# Altium schematic sheet ESP32.SchDoc
size A4; SheetNumber: 1; SheetTotal: 4
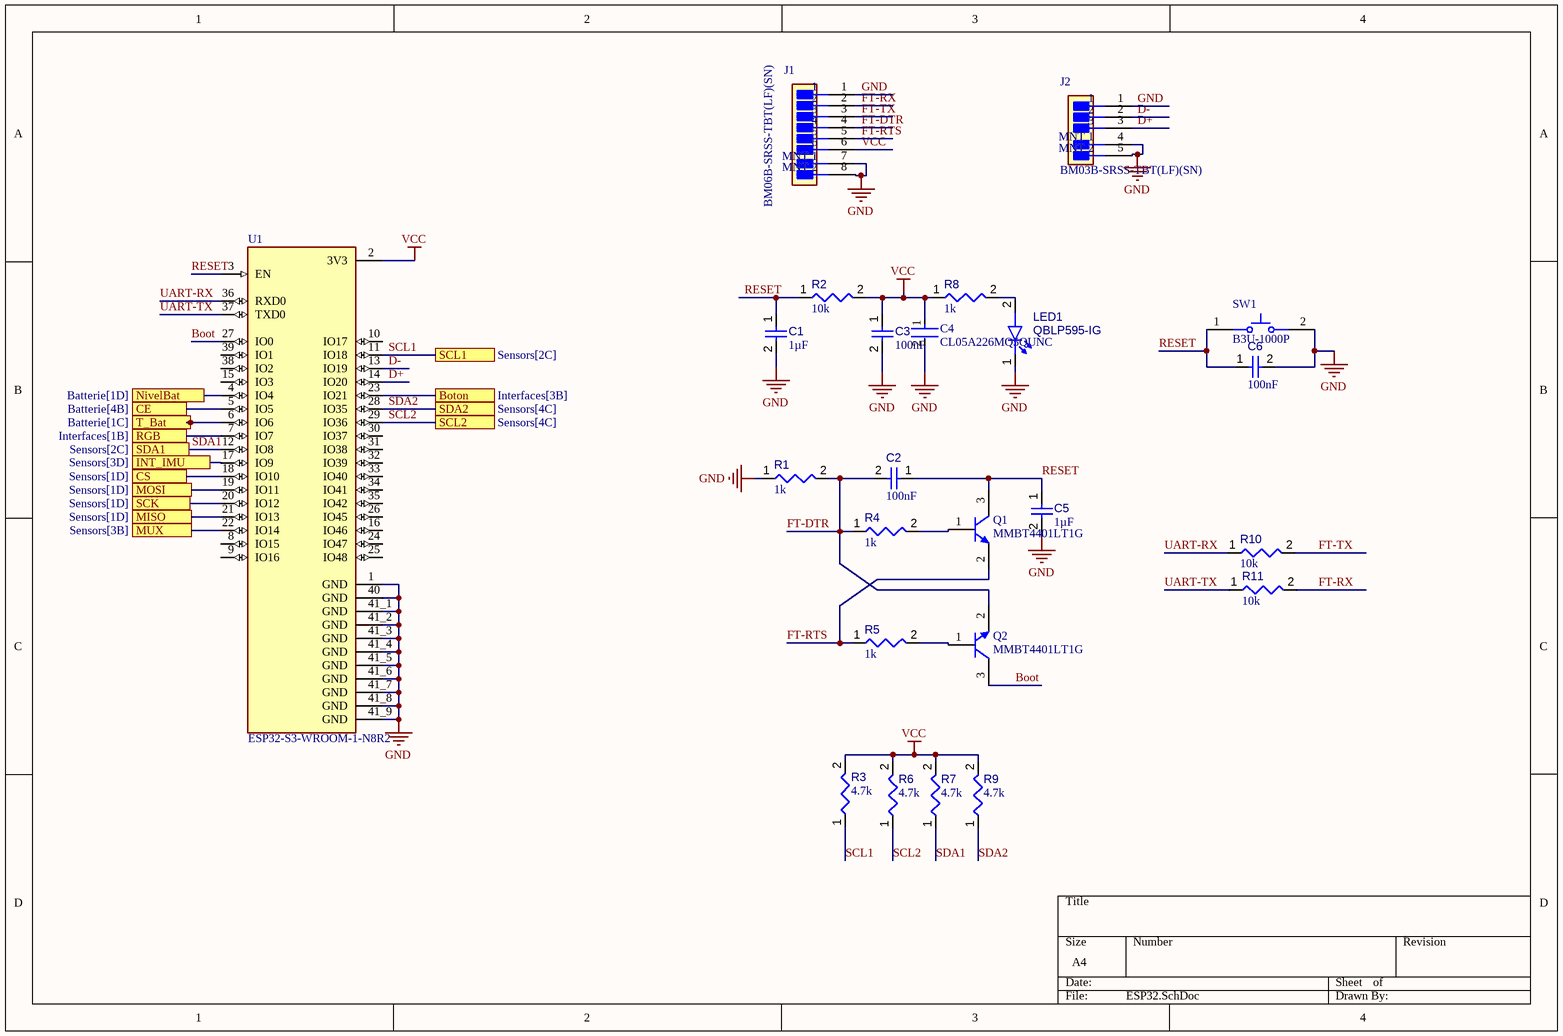
[diagram p0: ESP32.SchDoc]

## Parts
C1  value 1µF  [CAPC1005X55X25LL05T10]  (hidden comment: Capacitor 1 uF +/- 10% 6.3 V 0402)
C2  value 100nF  [CAPC1005X56X25LL10T15]  (hidden comment: Capacitor 0.1 uF +/- 5% 16 V 0402)
C3  value 100nF  [CAPC1005X56X25LL10T15]  (hidden comment: Capacitor 0.1 uF +/- 5% 16 V 0402)
C4  CL05A226MQ5QUNC  [FP-CL746-IPC_C]
C5  value 1µF  [CAPC1005X55X25LL05T10]  (hidden comment: Capacitor 1 uF +/- 10% 6.3 V 0402)
C6  value 100nF  [CAPC1005X56X25LL10T15]  (hidden comment: Capacitor 0.1 uF +/- 5% 16 V 0402)
J1  BM06B-SRSS-TBT(LF)(SN)  [FP-BM06B-SRSS-TBT_LF_SN-MFG]
J2  BM03B-SRSS-TBT(LF)(SN)  [FP-BM03B-SRSS-TBT_LF_SN-MFG]
LED1  QBLP595-IG  [QTB-QBLP595_V]
Q1  MMBT4401LT1G  [ONSC-SOT-23-3-318-08_V]
Q2  MMBT4401LT1G  [ONSC-SOT-23-3-318-08_V]
R1  value 1k  [RESC0402(1005)_L]  (hidden comment: Resistor 1K +/-5 % 0402 63 mW)
R2  value 10k  [RESC0402(1005)_L]  (hidden comment: Resistor 10K  +/-1 % 0402 63 mW)
R3  value 4.7k  [RESC1005X40X25ML05T05]  (hidden comment: Resistor 4k7 +/-1% 0402 100 mW)
R4  value 1k  [RESC0402(1005)_L]  (hidden comment: Resistor 1K +/-5 % 0402 63 mW)
R5  value 1k  [RESC0402(1005)_L]  (hidden comment: Resistor 1K +/-5 % 0402 63 mW)
R6  value 4.7k  [RESC1005X40X25ML05T05]  (hidden comment: Resistor 4k7 +/-1% 0402 100 mW)
R7  value 4.7k  [RESC1005X40X25ML05T05]  (hidden comment: Resistor 4k7 +/-1% 0402 100 mW)
R8  value 1k  [RESC0402(1005)_L]  (hidden comment: Resistor 1K +/-5 % 0402 63 mW)
R9  value 4.7k  [RESC1005X40X25ML05T05]  (hidden comment: Resistor 4k7 +/-1% 0402 100 mW)
R10  value 10k  [RESC0402(1005)_L]  (hidden comment: Resistor 10K  +/-1 % 0402 63 mW)
R11  value 10k  [RESC0402(1005)_L]  (hidden comment: Resistor 10K  +/-1 % 0402 63 mW)
SW1  B3U-1000P  [OMRON-B3U-1000_V]
U1  ESP32-S3-WROOM-1-N8R2  [XCVR_ESP32-S3-WROOM-1-N8R2]

## Ports
Boton (see Interfaces[3B]), CE (see Batterie[4B]), CS (see Sensors[1D]), INT_IMU (see Sensors[3D]), MISO (see Sensors[1D]), MOSI (see Sensors[1D]), MUX (see Sensors[3B]), NivelBat (see Batterie[1D]), RGB (see Interfaces[1B]), SCK (see Sensors[1D]), SCL1 (see Sensors[2C]), SCL2 (see Sensors[4C]), SDA1 (see Sensors[2C]), SDA2 (see Sensors[4C]), T_Bat (see Batterie[1C])

## Nets
GND: C1.2 C3.2 C4.2 C5.2 C6.2 J1.1 J1.7(MNT_1) J1.8(MNT_2) J2.1 J2.4(MNT_1) J2.5(MNT_2) LED1.1(K) R1.1 SW1.2 U1.1(GND) U1.40(GND) U1.41_1(GND) U1.41_2(GND) U1.41_3(GND) U1.41_4(GND) U1.41_5(GND) U1.41_6(GND) U1.41_7(GND) U1.41_8(GND) U1.41_9(GND)
VCC: C3.1 C4.1 J1.6 R2.2 R3.2 R6.2 R7.2 R8.1 R9.2 U1.2(3V3)
Boot: Q2.3(C) U1.27(IO0)
Boton: U1.23(IO21) ; port Boton
CE: U1.5(IO5) ; port CE
CS: U1.18(IO10) ; port CS
D+: J2.3 U1.14(IO20)
D-: J2.2 U1.13(IO19)
FT-DTR: C2.2 J1.4 Q2.2(E) R1.2 R4.1
FT-RTS: J1.5 Q1.2(E) R5.1
FT-RX: J1.2 R11.2
FT-TX: J1.3 R10.2
INT_IMU: U1.17(IO9) ; port INT_IMU
MISO: U1.21(IO13) ; port MISO
MOSI: U1.19(IO11) ; port MOSI
MUX: U1.22(IO14) ; port MUX
NivelBat: U1.4(IO4) ; port NivelBat
RESET: C1.1 C2.1 C5.1 C6.1 Q1.3(C) R2.1 SW1.1 U1.3(EN)
RGB: U1.7(IO7) ; port RGB
SCK: U1.20(IO12) ; port SCK
SCL1: R3.1 U1.11(IO18) ; port SCL1
SCL2: R6.1 U1.29(IO36) ; port SCL2
SDA1: R7.1 U1.12(IO8) ; port SDA1
SDA2: R9.1 U1.28(IO35) ; port SDA2
T_Bat: U1.6(IO6) ; port T_Bat
UART-RX: R10.1 U1.36(RXD0)
UART-TX: R11.1 U1.37(TXD0)
NetLED1_2: LED1.2(A) R8.2
NetQ1_1: Q1.1(B) R4.2
NetQ2_1: Q2.1(B) R5.2

Not connected (* = marked no-connect by the designer): U1 8(IO15) 9(IO16) 10(IO17) 15(IO3) 16(IO46) 24(IO47) 25(IO48) 26(IO45) 30(IO37) 31(IO38) 32(IO39) 33(IO40) 34(IO41) 35(IO42) 38(IO2) 39(IO1)

## Library data of the parts
C1 C5 = CMP-001-00008-6: Chip Capacitor, 1 uF, +/- 10%, 6.3 V, 0402 (1005 Metric); Capacitor Type: Ceramic; Voltage Rating: 6.3V; Max Operating Temperature: 85°C; Mounting Technology: SM; Tolerance: 10%; Case/Package: 0402; RoHS Compliant: True; Min Operating Temperature: -55°C; Pins: 2
C2 C3 C6 = CMP-001-00001-6: Chip Capacitor, 0.1 uF, +/- 5%, 16 V, 0402 (1005 Metric); Capacitor Type: Ceramic; Voltage Rating: 16V; Max Operating Temperature: 125°C; Min Operating Temperature: -55°C; Case/Package: 0402; Mounting Technology: SM; Pins: 2; Tolerance: 5%; RoHS Compliant: True
C4 = CMP-13271-000286-1: Cap Ceramic 22uF 6.3V X5R ±20% SMD 0402 +85°C Paper T/R; Case Code (Imperial): 0402; Tolerance: 20%; Width: 0.02inch; Packaging: Tape and Reel; Case/Package: 0402; Min Operating Temperature: -55°C; Max Operating Temperature: 85°C; Voltage Rating: 6.3V; Capacitance: 22uF; Thickness: 0.022inch; Mount: Surface Mount; Length: 0.039inch; Case Code (Metric): 1005
J1 = CMP-00030-00001-2: Conn Shrouded Header HDR 6 POS 1mm Solder ST SMD Embossed T/R
J2 = CMP-00030-00002-2: Conn Shrouded Header (4 Sides) HDR 3 POS 1mm Solder ST Top Entry SMD T/R
LED1 = CMP-007-00041-3: Chip LED 0402, Green, 0.02 A, 3.1 to 3.7 V, -40 to 80 degC, 2-Pin SMD, RoHS, Tape and Reel; Case/Package: 0402; Colour: Green; Mounting Technology: SMT; Pins: 2; RoHS Compliant: Yes
Q1 Q2 = CMP-1048-00545-1: Switching Transistor, NPN Silicon, 3-Pin SOT-23, Pb-Free, Tape and Reel; Manufacturer: On Semiconductor; IC Continuous (A): 0.6; fT Min (MHz): 250; Mounting Technology: Surface Mount; ComponentLink2URL: http://www.onsemi.cn/pub_link/Collateral/MMBT4401LT1-D.PDF; PackageDescription: 3-Pin Small Outline Transistor, Body 2.92 x 1.3 mm, Pitch 0.95 mm; ComponentLink3Description: Package Specification; Polarity: NPN; PackageReference: SOT-23-3-318-08; PackageVersion: Rev. AP, 11/2009; ComponentLink1URL: http://www.onsemi.com/; ComponentLink3URL: http://www.onsemi.cn/pub_link/Collateral/318-08.PDF; Packing: Tape and Reel; ComponentLink1Description: Manufacturer URL; PartNumber: MMBT4401LT1G; RoHS: TRUE; ComponentLink2Description: Datasheet; DatasheetVersion: Rev. 10
R1 R4 R5 R8 = CMP-009-00157-3: Chip Resistor, 1 kOhms, +/-5 %, 63 mW, -55 to 155 degC, 0402; Tolerance: 5%; Power: 63mW; Case/Package: 0402; Pins: 2; Min Operating Temperature: -55°C; Max Operating Temperature: 155°C
R2 R10 R11 = CMP-009-00149-3: Chip Resistor, 10 kOhms, +/-1 %, 63 mW, -55 to 125 degC, 0402; Power: 63mW; Tolerance: 1%; Min Operating Temperature: -55°C; Case/Package: 0402; Max Operating Temperature: 155°C; Pins: 2
R3 R6 R7 R9 = CMP-009-00030-5: Chip Resistor, 4.7 KOhm, +/- 1%, 0.1 W, -55 to 155 degC, 0402 (1005 Metric); Power: 100mW; Voltage Rating: 50V; Mounting Technology: SM; RoHS Compliant: True; Tolerance: 1%; Min Operating Temperature: -55°C; Max Operating Temperature: 155°C; Case/Package: 0402; Pins: 2
SW1 = CMP-011-00000-2: Tactile Switch, SPST-NO, 0.05 A, 12 V, -25 to 70 degC, 2-Pin SMD, RoHS, Tape and Reel; Manufacturer: Omron Electronic Components; IP Rating: IP40; Current Rating: 50mA; Max Contact Resistance: 100mohm; Operating Force: 153gf; Throw Configuration: SPST; Resistance: 0.1Ohm; Max Voltage Rating (DC): 12V; Contact Material: Silver; Max Current Rating: 50mA; Datasheet URL: http://www.omron.com/ecb/products/pdf/en-b3u.pdf; Mounting Technology: SM; Case/Package: B3U-1000; Packaging: TapeandReel; Package Reference: B3U-1000; Manufacturer URL: http://www.omron.com/; Datasheet Version: Jan-15; RoHS Compliant: True; Max Operating Temperature: 70°C; Contact Current Rating: 50mA; Package Quantity: 3500; Package Description: 2-Pin Surface Mount Device, Body 3 x 2.5 mm; Voltage Rating (DC): 12V; Min Operating Temperature: -25°C; Voltage Rating: 12V
U1 = CMP-003-000000-1: WiFi 802.11a/b/g/n, Bluetooth v5.0 Transceiver Module 2.4GHz Antenna Not Included -; MF: Espressif Systems; Component Type: Standard; Package: - Espressif Systems; SnapEDA_Link: https://www.snapeda.com/parts/ESP32-S3-WROOM-1-N8R2/Espressif+Systems/view-part/?ref=snap; Availability: In Stock; Purchase-URL: https://pricing.snapeda.com/search?q=ESP32-S3-WROOM-1-N8R2&ref=eda; Design Item ID: ESP32-S3-WROOM-1-N8R2; Price: None; Check_prices: https://www.snapeda.com/parts/ESP32-S3-WROOM-1-N8R2/Espressif+Systems/view-part/?ref=eda; Value: *; Source: ESP32-S3-WROOM-1-N8R2.SchLib; MP: ESP32-S3-WROOM-1-N8R2; Pin Count: 49